# Altium schematic sheet Temctrl_CPU.SchDoc
size A4
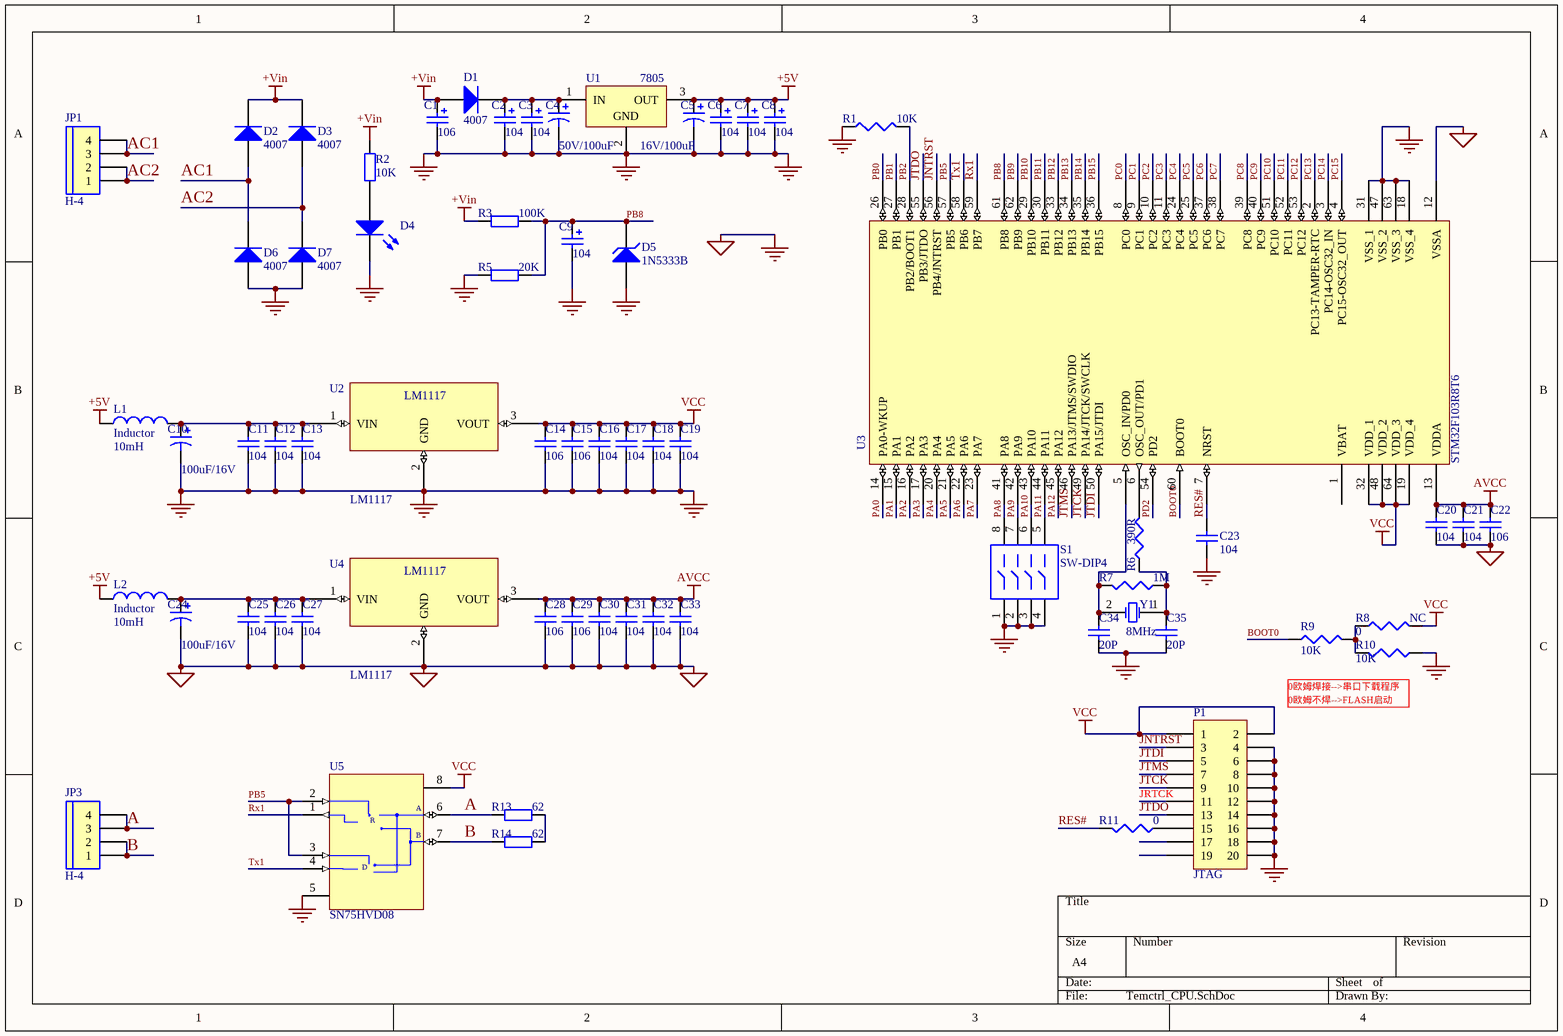
[diagram p0: Temctrl_CPU.SchDoc]

## Parts
C1  106  [0805]
C2  104  [0805]
C3  104  [0805]
C4  50V/100uF  [50V/100uF SOC]
C5  16V/100uF  [100/16V   SOC]
C6  104  [0805]
C7  104  [0805]
C8  104  [0805]
C9  104  [0805]
C10  100uF/16V  [100/16V   SOC]
C11  104  [0805]
C12  104  [0805]
C13  104  [0805]
C14  106  [0805]
C15  106  [0805]
C16  104  [0805]
C17  104  [0805]
C18  104  [0805]
C19  104  [0805]
C20  104  [0805]
C21  104  [0805]
C22  106  [0805]
C23  104  [0805]
C24  100uF/16V  [100/16V   SOC]
C25  104  [0805]
C26  104  [0805]
C27  104  [0805]
C28  106  [0805]
C29  106  [0805]
C30  104  [0805]
C31  104  [0805]
C32  104  [0805]
C33  104  [0805]
C34  20P  [0805]
C35  20P  [0805]
D1  4007  [DIODE0.4]
D2  4007  [DIODE0.4]
D3  4007  [DIODE0.4]
D4  LED0  [LED0.1-0.22]  (value not drawn)
D5  1N5333B  [DIODE0.4]
D6  4007  [DIODE0.4]
D7  4007  [DIODE0.4]
JP1  H-4  [P4]
JP3  H-4  [P4]
L1  Inductor  value 10mH  [0805]
L2  Inductor  value 10mH  [0805]
P1  JTAG  [HDR2X10]
R1  10K  [0805]
R2  10K  [0805]
R3  100K  [0805]
R5  20K  [0805]
R6  390R  [0805]
R7  1M  [0805]
R8  NC  value 0  [0805]
R9  10K  [0805]
R10  10K  [0805]
R11  0  [0805]
R13  62  [0805]
R14  62  [0805]
S1  SW-DIP4  [SW-DIP-4]
U1  7805  [SIP-W3 /SRQ25]
U2  LM1117  [DSO-G3/P2.3]
U3  STM32F103R8T6  [LQFP64_N]
U4  LM1117  [DSO-G3/P2.3]
U5  SN75HVD08  [SOP8-max485]
Y1  value 8MHz  [XTL]  (hidden comment: XTAL)

## Nets
+5V: C5.1 C6.1 C7.1 C8.1 L1.1 L2.1 U1.3(OUT)
+Vin: C1.1 D1.1(A) D2.2(K) D3.2(K) R2.1 R3.2
AGND: C1.2 C2.2 C3.2 C4.2 C5.2 C6.2 C7.2 C8.2 C9.2 C10.2 C11.2 C12.2 C13.2 C14.2 C15.2 C16.2 C17.2 C18.2 C19.2 C20.1 C21.1 C22.1 C23.2 C24.2 C25.2 C26.2 C27.2 C28.2 C29.2 C30.2 C31.2 C32.2 C33.2 C34.1 C35.1 D4.2(K) D5.1(A) D6.1(A) D7.1(A) P1.4 P1.6 P1.8 P1.10 P1.12 P1.14 P1.16 P1.18 P1.20 R1.1 R5.2 R10.1 S1.1 S1.2 S1.3 S1.4 U1.2(GND) U2.2(GND) U3.12(VSSA) U3.18(VSS_4) U3.31(VSS_1) U3.47(VSS_2) U3.63(VSS_3) U4.2(GND) U5.5(GND)  [also labelled GND]
AVCC: C20.2 C21.2 C22.2 C28.1 C29.1 C30.1 C31.1 C32.1 C33.1 U3.13(VDDA) U4.3(VOUT)
VCC: C14.1 C15.1 C16.1 C17.1 C18.1 C19.1 P1.1 P1.2 R8.2 U2.3(VOUT) U3.19(VDD_4) U3.32(VDD_1) U3.48(VDD_2) U3.64(VDD_3) U5.8(VCC)
A: JP3.3 JP3.4 R13.2 U5.6(A)
AC1: D2.1(A) D6.2(K) JP1.3 JP1.4
AC2: D3.1(A) D7.2(K) JP1.1 JP1.2
B: JP3.1 JP3.2 R14.2 U5.7(B)
BOOT0: R9.1 U3.60(BOOT0)
JNTRST: P1.3 U3.56(PB4/JNTRST)
JTCK: P1.9 U3.49(PA14/JTCK/SWCLK)
JTDI: P1.5 U3.50(PA15/JTDI)
JTDO: P1.13 U3.55(PB3/JTDO)
JTMS: P1.7 U3.46(PA13/JTMS/SWDIO)
PA0: U3.14(PA0-WKUP)
PA1: U3.15(PA1)
PA2: U3.16(PA2)
PA3: U3.17(PA3)
PA4: U3.20(PA4)
PA5: U3.21(PA5)
PA6: U3.22(PA6)
PA7: U3.23(PA7)
PA8: S1.8 U3.41(PA8)
PA9: S1.7 U3.42(PA9)
PA10: S1.6 U3.43(PA10)
PA11: S1.5 U3.44(PA11)
PA12: U3.45(PA12)
PB0: U3.26(PB0)
PB1: U3.27(PB1)
PB2: R1.2 U3.28(PB2/BOOT1)
PB5: U3.57(PB5) U5.2(~{RE}) U5.3(DE)
PB8: C9.1 D5.2(K) R3.1 R5.1 U3.61(PB8)
PB9: U3.62(PB9)
PB10: U3.29(PB10)
PB11: U3.30(PB11)
PB12: U3.33(PB12)
PB13: U3.34(PB13)
PB14: U3.35(PB14)
PB15: U3.36(PB15)
PC0: U3.8(PC0)
PC1: U3.9(PC1)
PC2: U3.10(PC2)
PC3: U3.11(PC3)
PC4: U3.24(PC4)
PC5: U3.25(PC5)
PC6: U3.37(PC6)
PC7: U3.38(PC7)
PC8: U3.39(PC8)
PC9: U3.40(PC9)
PC10: U3.51(PC10)
PC11: U3.52(PC11)
PC12: U3.53(PC12)
PC13: U3.2(PC13-TAMPER-RTC)
PC14: U3.3(PC14-OSC32_IN)
PC15: U3.4(PC15-OSC32_OUT)
PD2: U3.54(PD2)
RES#: C23.1 R11.2 U3.7(NRST)
Rx1: U3.59(PB7) U5.1(RO)
Tx1: U3.58(PB6) U5.4(DI)
NetC2_1: C2.1 C3.1 C4.1 D1.2(K) U1.1(IN)
NetC10_1: C10.1 C11.1 C12.1 C13.1 L1.2 U2.1(VIN)
NetC24_1: C24.1 C25.1 C26.1 C27.1 L2.2 U4.1(VIN)
NetC34_2: C34.2 R7.2 U3.5(OSC_IN/PD0) Y1.2(OSC2)
NetC35_2: C35.2 R6.1 R7.1 Y1.1(OSC1)
NetD4_1: D4.1(A) R2.2
NetP1_15: P1.15 R11.1
NetR6_2: R6.2 U3.6(OSC_OUT/PD1)
NetR8_1: R8.1 R9.2 R10.2
NetR13_1: R13.1 R14.1

Not connected (* = marked no-connect by the designer): P1 11 17 19; U3 1(VBAT)

## Notes on the sheet
- 0欧姆不焊-->FLASH启动
- 0欧姆焊接-->串口下载程序
- JRTCK
- (in symbol MAX485CPA) R; D

## Library data of the parts
C1 C9 = Cap Pol2: Polarized Capacitor (Axial); Manufacturer: Generic Components; Class: Passive; Value: 10uF; Published: 08/06/2000; Publisher: Altium Hobart Technology Centre; SubClass: Capacitor
C2 C3 C6-C8 = Cap Pol2: Polarized Capacitor (Axial); Manufacturer: Generic Components; Class: Passive; Published: 08/06/2000; Publisher: Altium Hobart Technology Centre; SubClass: Capacitor
C4 C5 C10 C24 = Cap Pol1: Polarized Capacitor (Radial); Value: 100pF; Published: 8-Jun-2000; LatestRevisionDate: 17-Jul-2002; LatestRevisionNote: Re-released for DXP Platform.; PackageReference: RB7.6-15; Publisher: Altium Limited
C11-C13 C16-C19 C25-C27 C30-C33 = Cap: Capacitor; Published: 8-Jun-2000; LatestRevisionDate: 17-Jul-2002; LatestRevisionNote: Re-released for DXP Platform.; PackageReference: RAD-0.3; Publisher: Altium Limited; Value: 104
C14 C15 C28 C29 = Cap: Capacitor; Value: 104; Published: 8-Jun-2000; LatestRevisionDate: 17-Jul-2002; LatestRevisionNote: Re-released for DXP Platform.; PackageReference: RAD-0.3; Publisher: Altium Limited
C20 C21 C23 = Cap Semi: Capacitor (Semiconductor SIM Model); Published: 8-Jun-2000; Revision: July-2002: Re-released for DXP Platform.; Publisher: Altium Limited; Value: 104
C22 C34 C35 = Cap Semi: Capacitor (Semiconductor SIM Model); Value: 104; Published: 8-Jun-2000; Revision: July-2002: Re-released for DXP Platform.; Publisher: Altium Limited
D1-D3 D6 D7 = Diode: Default Diode; Manufacturer: Generic Components; Class: Discrete; SubClass: Diode - Switching; Published: 08/06/2000; Publisher: Altium Hobart Technology Centre
D4 = LED0: Typical INFRARED GaAs LED; Published: 8-Jun-2000; LatestRevisionDate: 08-Jul-2005; LatestRevisionNote: Mech Layer 1 removed.; PackageReference: LED-0; Publisher: Altium Limited
D5 = D Zener: Zener Diode; Published: 8-Jun-2000; LatestRevisionDate: 17-Jul-2002; LatestRevisionNote: Re-released for DXP Platform.; PackageReference: DIODE-0.7; Publisher: Altium Limited
JP1 JP3 = H-4: Header, 4-Pin; Manufacturer: Generic Components; Class: Connector
L1 L2 = Inductor: Code_IEC: 1005; Published: 8-Jun-2000; LatestRevisionDate: 17-Jul-2002; LatestRevisionNote: Re-released for DXP Platform.; PackageReference: 0402-A; Publisher: Altium Limited; Code_JEITA: 0402
P1 = Header 10X2: Header, 10-Pin, Dual row; LatestRevisionDate: 17-Jul-2002; LatestRevisionNote: Re-released for DXP Platform.; Publisher: Altium Limited
R1 R6 R7 R9-R11 = Res3: Resistor; Value: 0~200K; Published: 8-Jun-2000; Revision: July-2002: Re-released for DXP Platform.; Publisher: Altium Limited
R2 R3 R5 R13 R14 = Res: Resistor; Manufacturer: Generic Components; Class: Passive; Published: 08/06/2000; Publisher: Altium Hobart Technology Centre; SubClass: Resistor
R8 = Res3: Resistor; Published: 8-Jun-2000; Revision: July-2002: Re-released for DXP Platform.; Publisher: Altium Limited
S1 = SW-DIP4: DIP Switch,4-bit; Manufacturer: Generic Components; Published: 1999
U1 = 78*05
U3 = STM32F103R8T6: STM32 ARM-based 32-bit MCU with 64 Kbytes Flash, 64-pin LQFP, Industrial Temperature; Published: 30-May-2008; DatasheetVersion: rev6, Mar-2008; PackageVersion: Mar-2008; PackageReference: LQFP64; Publisher: Altium Limited; PackageDescription: 64-Pin Low-Profile Quad Flat Pack, 10 x 10 mm Body, 0.5 mm Pitch (LQFP64); ComponentLink1Description: Manufacturer Link; ComponentLink1URL: www.st.com/stm32; ComponentLink2Description: Datasheet; ComponentLink2URL: http://www.st.com/stonline/products/literature/ds/13587.pdf
U5 = MAX485CPA: Low-Power, Slew-Rate-Limited RS-485/RS-422 Transceiver; Manufacturer: Maxim; Class: Communication; Published: 16/01/2001; Publisher: Altium Hobart Technology Centre; SubClass: Transceiver
Y1 = XTAL: Crystal Oscillator; Manufacturer: Generic Components; Published: 08/06/2000; Publisher: Altium Hobart Technology Centre; Class: Oscillator; SubClass: Crystal Oscillator